# EAGLE schematic rPiMotors_v1.2 (EAGLE 7.7.0)
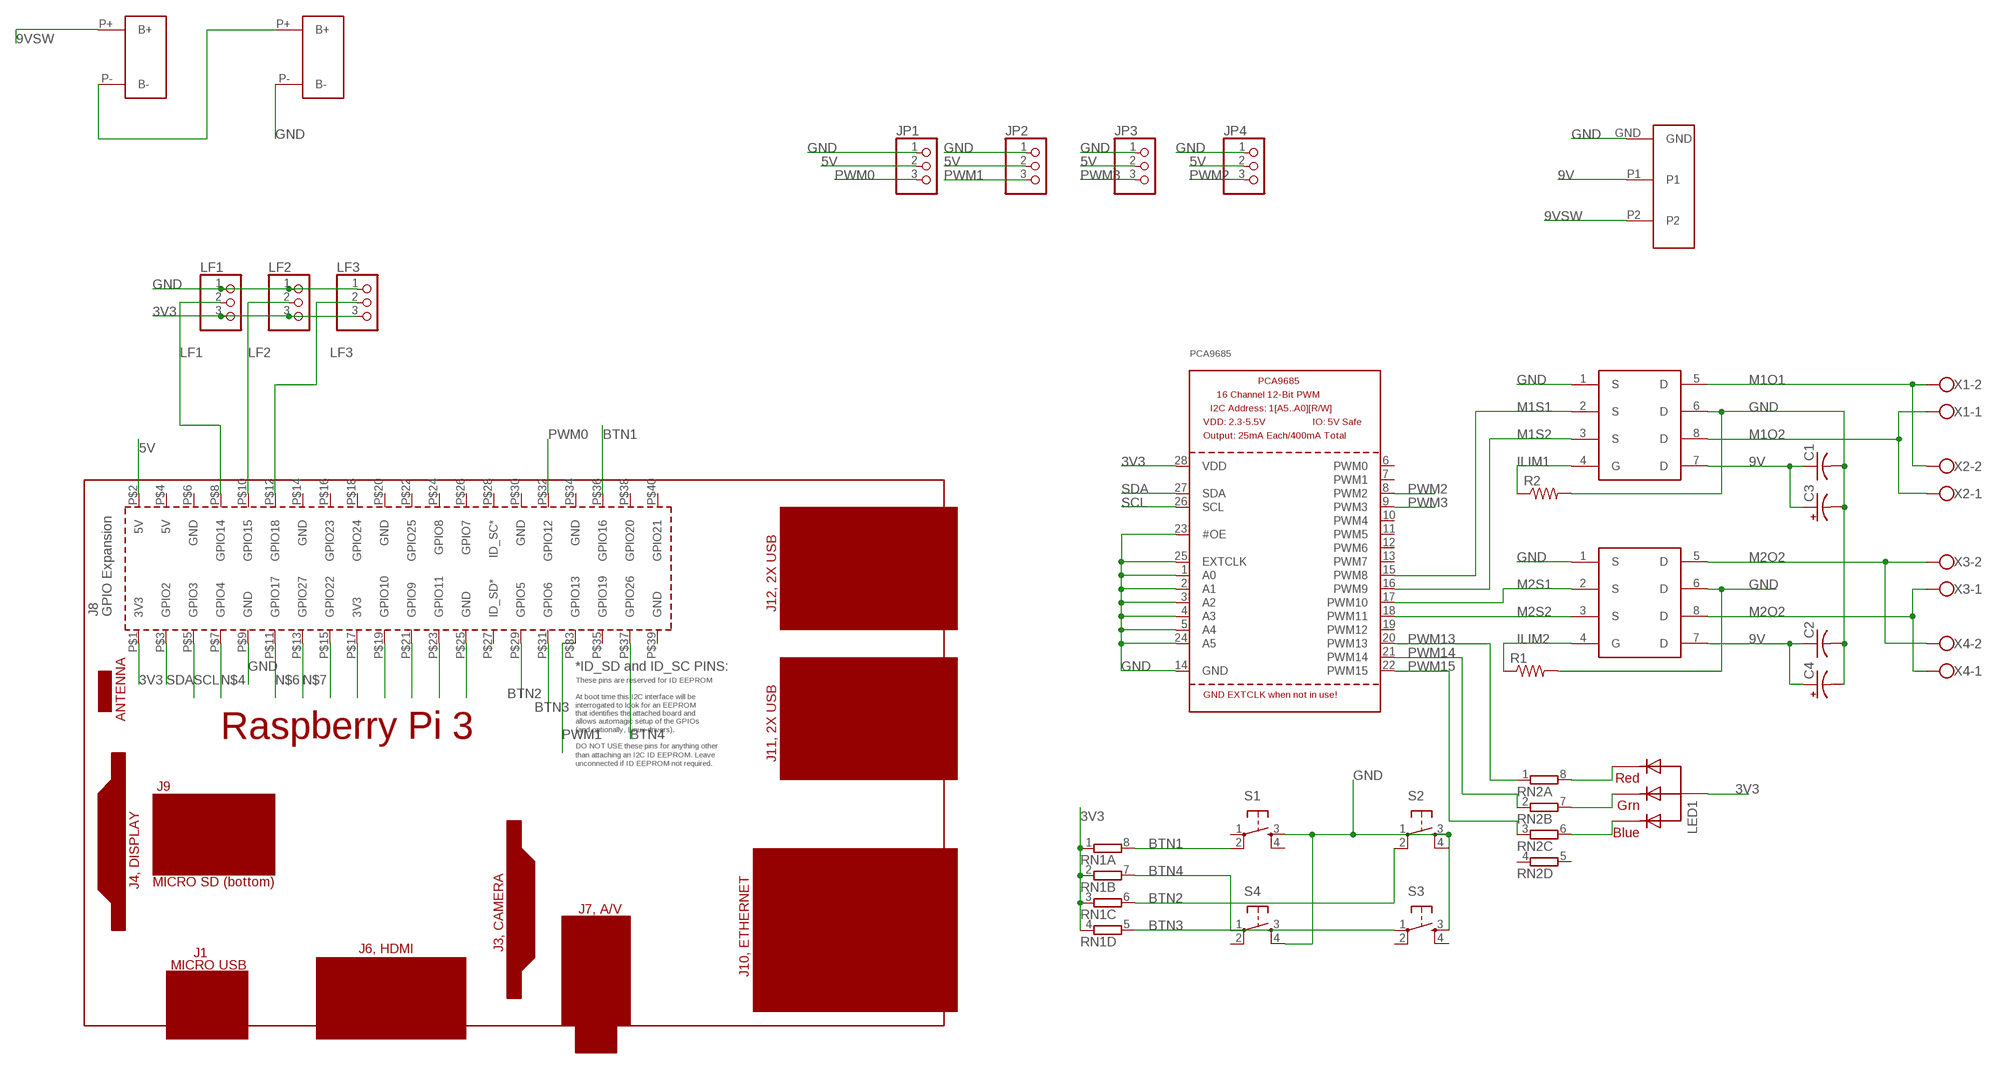
[diagram p0: schematic, sheet 1]

## Parts
C1  C-USC0603  [C0603]
C2  C-USC0603  [C0603]
C3  CPOL-USD  [PANASONIC_D]
C4  CPOL-USD  [PANASONIC_D]
JP1  PINHD-1X3  [1X03]
JP2  PINHD-1X3  [1X03]
JP3  PINHD-1X3  [1X03]
JP4  PINHD-1X3  [1X03]
LED1  RGBLED_CA  [5MMRGB]
LF1  PINHD-1X3  [1X03]
LF2  PINHD-1X3  [1X03]
LF3  PINHD-1X3  [1X03]
PCA9685  PCA9685  [TSSOP28]
PCB1  RPI3  [RPI3]
R1  R-US_R0603  [R0603]
R2  R-US_R0603  [R0603]
RN1  4R-N0603-ARV  [0603-ARV]
RN2  4R-N0603-ARV  [0603-ARV]
S1  TAC_SWITCHPTH  [TACTILE-PTH]
S2  TAC_SWITCHPTH  [TACTILE-PTH]
S3  TAC_SWITCHPTH  [TACTILE-PTH]
S4  TAC_SWITCHPTH  [TACTILE-PTH]
U$1  NDS8434  [SO08]
U$2  NDS8434  [SO08]
U$3  ROCKER  [ROCKER]
U$4  BATTERY  [BATTERY]
U$5  BATTERY  [BATTERY]
X1  SCREWCONNECTOR  [2PIN-SCREW-TERMINAL]
X2  SCREWCONNECTOR  [2PIN-SCREW-TERMINAL]
X3  SCREWCONNECTOR  [2PIN-SCREW-TERMINAL]
X4  SCREWCONNECTOR  [2PIN-SCREW-TERMINAL]

## Nets
3V3: LED1.2(VCC) LF1.3 LF2.3 LF3.3 PCA9685.28(VDD) PCB1.P$1(3V3) RN1.1 RN1.2 RN1.3 RN1.4
5V: JP1.2 JP2.2 JP3.2 JP4.2 PCB1.P$2(5V)
9V: C1.1 C2.1 C3.+ C4.+ U$1.7(D) U$2.7(D) U$3.P1
9VSW: U$3.P2 U$4.P+(B+)
BTN1: PCB1.P$36(GPIO16) RN1.8 S1.2
BTN2: PCB1.P$29(GPIO5) RN1.6 S2.2
BTN3: PCB1.P$31(GPIO6) RN1.5 S3.1
BTN4: PCB1.P$37(GPIO26) RN1.7 S4.1
GND: C1.2 C2.2 C3.- C4.- JP1.1 JP2.1 JP3.1 JP4.1 LF1.1 LF2.1 LF3.1 PCA9685.1(A0) PCA9685.2(A1) PCA9685.3(A2) PCA9685.4(A3) PCA9685.5(A4) PCA9685.14(GND) PCA9685.23(#OE) PCA9685.24(A5) PCA9685.25(EXTCLK) PCB1.P$9(GND) R1.2 R2.2 S1.3 S2.3 S3.3 S4.4 U$1.1(S) U$1.6(D) U$2.1(S) U$2.6(D) U$3.GND U$5.P-(B-)
ILIM1: R2.1 U$1.4(G)
ILIM2: R1.1 U$2.4(G)
LF1: LF1.2 PCB1.P$8(GPIO14)
LF2: LF2.2 PCB1.P$10(GPIO15)
LF3: LF3.2 PCB1.P$12(GPIO18)
M1O1: U$1.5(D) X1.2 X2.2
M1O2: U$1.8(D) X1.1 X2.1
M1S1: PCA9685.15(PWM8) U$1.2(S)
M1S2: PCA9685.16(PWM9) U$1.3(S)
M2O2: U$2.5(D) U$2.8(D) X3.1 X3.2 X4.1 X4.2
M2S1: PCA9685.17(PWM10) U$2.2(S)
M2S2: PCA9685.18(PWM11) U$2.3(S)
N$1: LED1.1(BLUE) RN2.6
N$2: LED1.3(GREEN) RN2.7
N$3: LED1.4(RED) RN2.8
N$4: PCB1.P$7(GPIO4)
N$6: PCB1.P$11(GPIO17)
N$7: PCB1.P$13(GPIO27)
N$8: PCB1.P$15(GPIO22)
N$9: PCB1.P$17(3V3)
N$10: PCB1.P$19(GPIO10)
N$11: PCB1.P$21(GPIO9)
N$12: PCB1.P$23(GPIO11)
N$13: PCB1.P$25(GND)
N$22: U$4.P-(B-) U$5.P+(B+)
PWM0: JP1.3 PCB1.P$32(GPIO12)
PWM1: JP2.3 PCB1.P$33(GPIO13)
PWM2: JP4.3 PCA9685.8(PWM2)
PWM3: JP3.3 PCA9685.9(PWM3)
PWM13: PCA9685.20(PWM13) RN2.1
PWM14: PCA9685.21(PWM14) RN2.2
PWM15: PCA9685.22(PWM15) RN2.3
SCL: PCA9685.26(SCL) PCB1.P$5(GPIO3)
SDA: PCA9685.27(SDA) PCB1.P$3(GPIO2)
Unconnected: PCA9685.6(PWM0) PCA9685.7(PWM1) PCA9685.10(PWM4) PCA9685.11(PWM5) PCA9685.12(PWM6) PCA9685.13(PWM7) PCA9685.19(PWM12) PCB1.P$4(5V) PCB1.P$6(GND) PCB1.P$14(GND) PCB1.P$16(GPIO23) PCB1.P$18(GPIO24) PCB1.P$20(GND) PCB1.P$22(GPIO25) PCB1.P$24(GPIO8) PCB1.P$26(GPIO7) PCB1.P$27(ID_SD*) PCB1.P$28(ID_SC*) PCB1.P$30(GND) PCB1.P$34(GND) PCB1.P$35(GPIO19) PCB1.P$38(GPIO20) PCB1.P$39(GND) PCB1.P$40(GPIO21) RN2.4 RN2.5 S1.1 S1.4 S2.1 S2.4 S3.2 S3.4 S4.2 S4.3

## Library data of the parts
C1 C2 = adafruit:C-US: CAPACITOR, American symbol
C3 C4 = adafruit:CPOL-US: POLARIZED CAPACITOR, American symbol
JP1-JP4 LF1-LF3 = adafruit:PINHD-1X3: PIN HEADER
LED1 = adafruit:RGBLED_CA: RGB LED, common-anode 5MM Staggered pins 5mm Piranha package http://www.ladyada.net/library/pcb/eaglelibrary.html
PCA9685 = adafruit:PCA9685: PCA9685 - 16 Channel 12-Bit I2C PWM Controller 5.0V tolerant 16 channel, 12-bit I2C PWM controller with 25mA per output (max. 400mA total) Digikey: 568-5931-1-ND
PCB1 = e14_Rpi3_RevA:RPI3: Device for Raspberry Pi 3 board created by Dave Young for www.element14.com More information and support community is available at https://www.element14.com/community/community/raspberry-pi
R1 R2 = adafruit:R-US_: RESISTOR, American symbol
RN1 RN2 = resistor-dil:4R-N: Array Chip Resistor Source: RS Component / Phycomp; OC_FARNELL: unknown; OC_NEWARK: unknown
S1-S4 = SparkFun-Retired:TAC_SWITCH: Momentary Switch Button commonly used for reset or general input. Spark Fun Electronics SKU : COM-00097 SMT- SWCH-08247
U$1 U$2 = SparkFun-DiscreteSemi:NDS8434: 8-SOIC NMOSFET
U$3 = ISCTRainingProgram:ROCKER
U$4 U$5 = ISCTRainingProgram:BATTERY
X1-X4 = ISCTRainingProgram:SCREWCONNECTOR: WAGO SCREW CLAMP; MPN: 237-102; OC_FARNELL: unknown; OC_NEWARK: 70K9898